# EAGLE schematic SNES_RGBAmp (EAGLE 6.5.0)
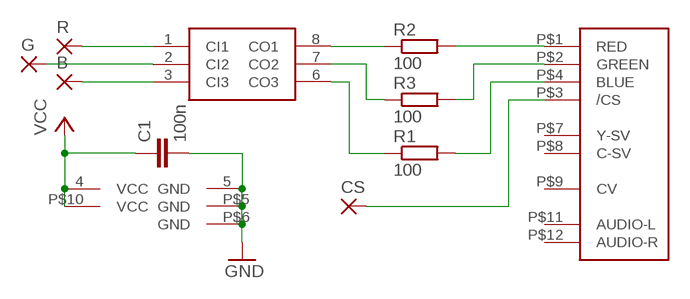
[diagram p0: schematic, sheet 1]

## Parts
B  SMD2  [SMD1,27-2,54]
C1  100n  C0805  [Z0805]
CS  SMD2  [SMD1,27-2,54]
G  SMD2  [SMD1,27-2,54]
R  SMD2  [SMD1,27-2,54]
R1  100  R0805  [Z0805]
R2  100  R0805  [Z0805]
R3  100  R0805  [Z0805]
U$1  THS7314  [THS7314]
U$2  SNES_MULTIAV  [SNES_MULTIAV]

## Nets
GND: C1.2 U$1.5(GND) U$2.P$5(GND) U$2.P$6(GND)
N$1: R.1(P) U$1.1(CI1)
N$2: G.1(P) U$1.2(CI2)
N$3: B.1(P) U$1.3(CI3)
N$4: R2.1 U$1.8(CO1)
N$5: R2.2 U$2.P$1(RED)
N$6: R3.2 U$2.P$2(GREEN)
N$7: R3.1 U$1.7(CO2)
N$8: R1.1 U$1.6(CO3)
N$9: R1.2 U$2.P$4(BLUE)
N$10: CS.1(P) U$2.P$3(/CS)
VCC: C1.1 U$1.4(VCC) U$2.P$10(VCC)
Unconnected: U$2.P$7(Y-SV) U$2.P$8(C-SV) U$2.P$9(CV) U$2.P$11(AUDIO-L) U$2.P$12(AUDIO-R)

## Library data of the parts
B CS G R = wirepad:SMD2: SMD PAD
C1 = snescart:C0805
R1-R3 = snescart:R0805
U$1 = snescart:THS7314
U$2 = snescart:SNES_MULTIAV